# EAGLE design RPi-WS2812-HAT_v10 (EAGLE 7.5.0)

## Sheet 1 of 2
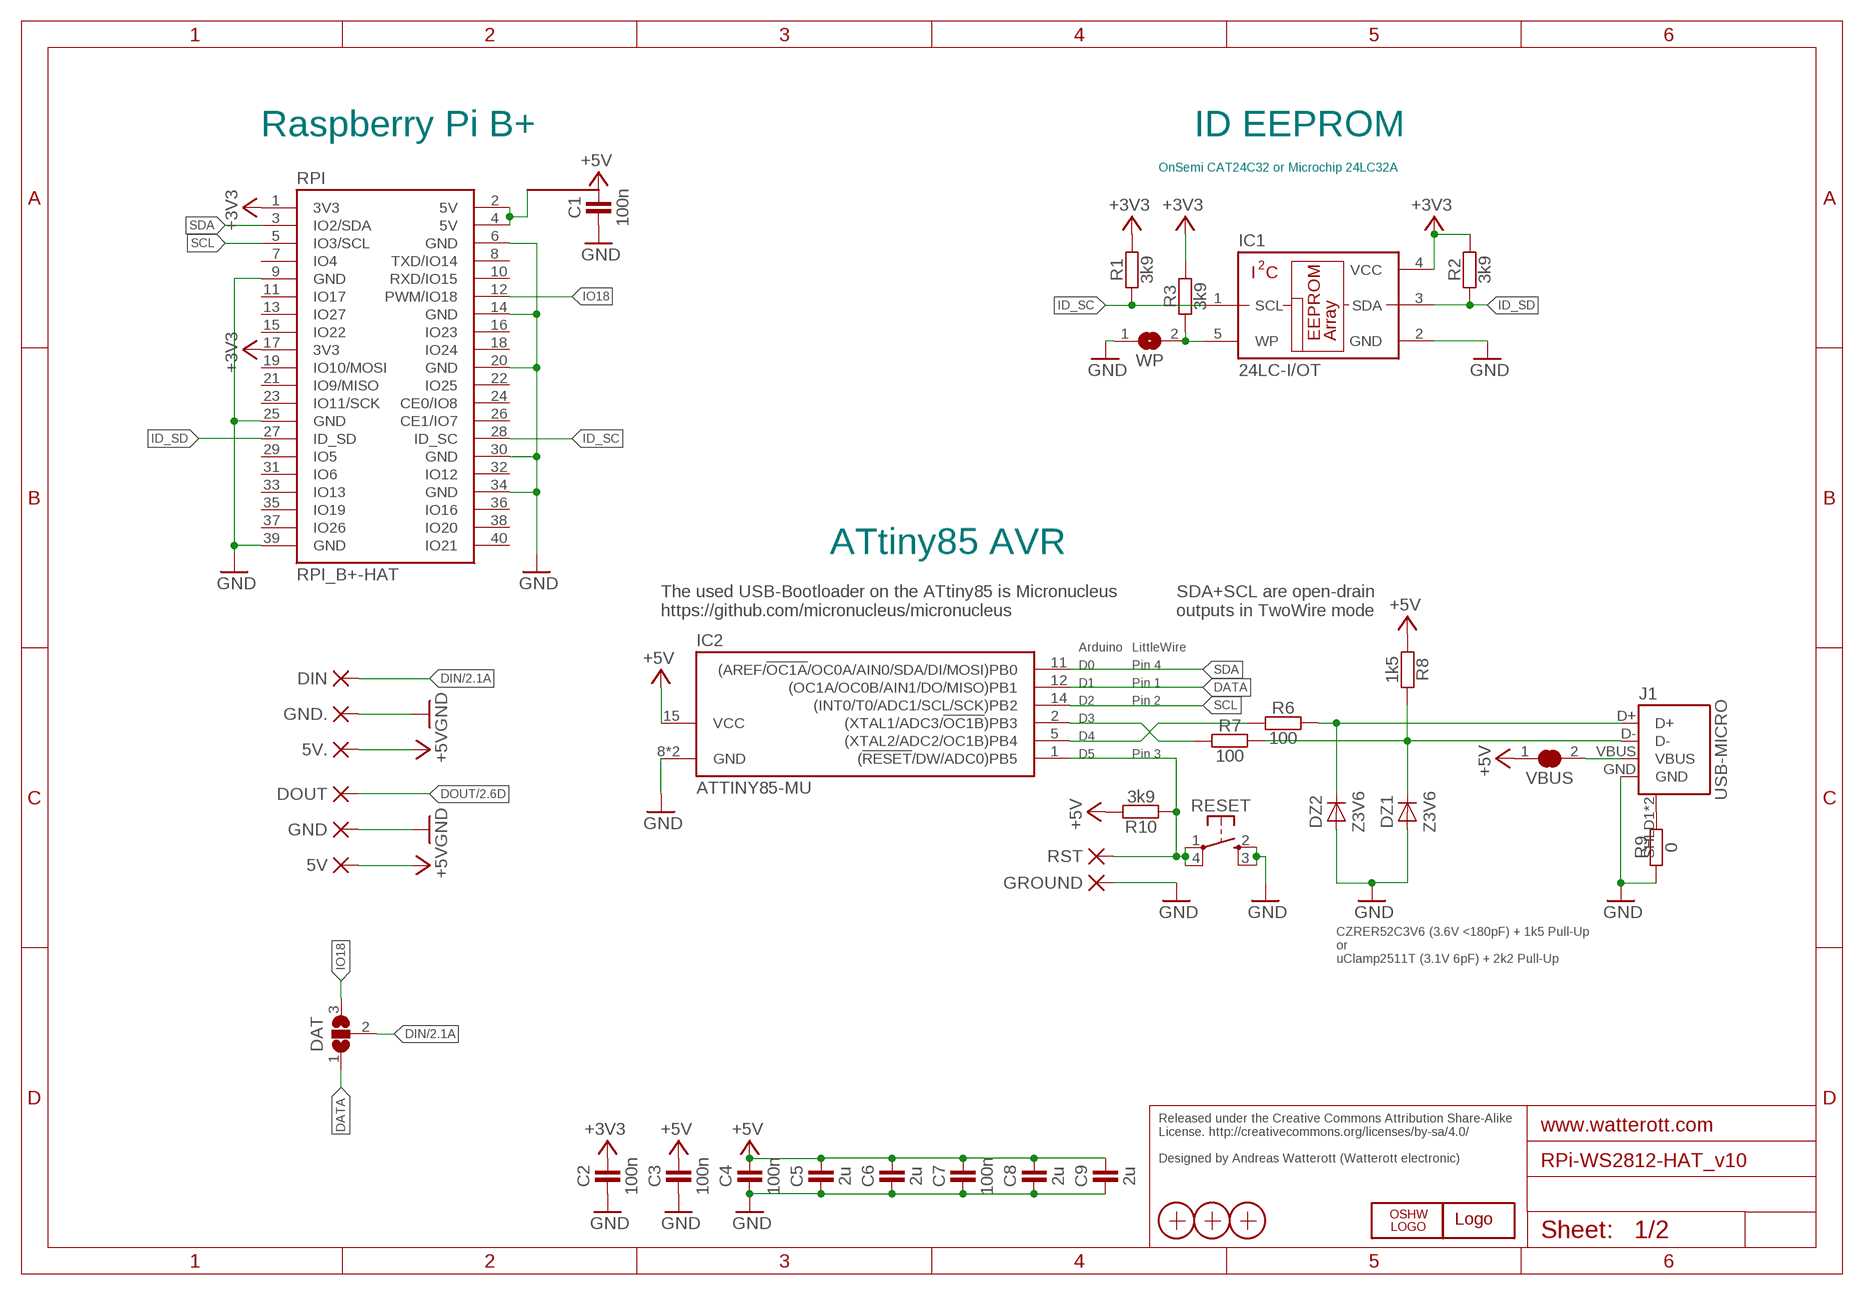
[diagram p0: schematic, sheet 1]

### Parts
5V  PAD-1.27X2.54_NC  [PAD-1.27X2.54_NC]
5V.  PAD-1.27X2.54_NC  [PAD-1.27X2.54_NC]
C1  100n  CAPACITOR-0402  [C0402]
C2  100n  CAPACITOR-0402  [C0402]
C3  100n  CAPACITOR-0402  [C0402]
C4  100n  CAPACITOR-0402  [C0402]
C5  2u  CAPACITOR-0402  [C0402]
C6  2u  CAPACITOR-0402  [C0402]
C7  100n  CAPACITOR-0402  [C0402]
C8  2u  CAPACITOR-0402  [C0402]
C9  2u  CAPACITOR-0402  [C0402]
DAT  JUMPER3-0603  [JUMPER3-0603]
DIN  PAD-1.27X2.54_NC  [PAD-1.27X2.54_NC]
DOUT  PAD-1.27X2.54_NC  [PAD-1.27X2.54_NC]
DZ1  Z3V6  DIODE-SOD882  [SOD882]
DZ2  Z3V6  DIODE-SOD882  [SOD882]
GND  PAD-1.27X2.54_NC  [PAD-1.27X2.54_NC]
GND.  PAD-1.27X2.54_NC  [PAD-1.27X2.54_NC]
GROUND  PAD-1.27X1.27_NC  [PAD-1.27X1.27_NC]
IC1  24LC-I/OT  [SOT23-5]
IC2  ATTINY85-MU  [QFN20-PAD]
J1  USB-MICRO  [USB-MICRO-10103594]
LOGO1  LOGO-S_PLACE_S  [SPARK_TPLACE_S]
LOGO2  OSHW_LOGOX0070  [OSHW_6X70]
R1  3k9  RESISTOR-0402  [C0402]
R2  3k9  RESISTOR-0402  [C0402]
R3  3k9  RESISTOR-0402  [C0402]
R6  100  RESISTOR-0402  [C0402]
R7  100  RESISTOR-0402  [C0402]
R8  1k5  RESISTOR-0402  [C0402]
R9  0  RESISTOR-0402  [C0402]
R10  3k9  RESISTOR-0402  [C0402]
RESET  SW-TACTILE-TL3315  [SW_TL3315N]
RPI  RPI_B+-HAT  [RPI-B+HAT]
RST  PAD-1.27X1.27_NC  [PAD-1.27X1.27_NC]
VBUS  JUMPER2-0603-NC  [JUMPER2-0603_NC]
WP  JUMPER2-0603-NC  [JUMPER2-0603_NC]
X1  PASSER-07  [PASSER_07MM]
X2  PASSER-07  [PASSER_07MM]
X3  PASSER-07  [PASSER_07MM]

### Nets
5V: RPI.2(5V) RPI.4(5V)
+3V3: C2.2 IC1.4(VCC) R1.2 R2.2 R3.2 RPI.1(3V3) RPI.17(3V3)
+5V: 5V.1(P) 5V..1(P) C1.2 C3.2 C4.2 C5.2 C6.2 C7.2 C8.2 C9.2 IC2.15(VCC) R8.1 R10.2 VBUS.1 ; also sheet 2
D2_N: IC2.2((XTAL1/ADC3/!OC1B!)PB3) R7.1
D2_P: IC2.5((XTAL2/ADC2/OC1B)PB4) R6.1
D_N: DZ1.C J1.D- R7.2 R8.2
D_P: DZ2.C J1.D+ R6.2
DATA: DAT.1 IC2.12((OC1A/OC0B/AIN1/DO/MISO)PB1)
DIN: DAT.2 DIN.1(P) ; also sheet 2
DOUT: DOUT.1(P) ; also sheet 2
GND: C1.1 C2.1 C3.1 C4.1 C5.1 C6.1 C7.1 C8.1 C9.1 DZ1.A DZ2.A GND.1(P) GND..1(P) GROUND.1(P) IC1.2(GND) IC2.8(GND) IC2.TP(GND) J1.GND R9.1 RESET.2(S1) RESET.3(S2) RPI.6(GND) RPI.9(GND) RPI.14(GND) RPI.20(GND) RPI.25(GND) RPI.30(GND) RPI.34(GND) RPI.39(GND) WP.1 ; also sheet 2
ID_SC: IC1.1(SCL) R1.1 RPI.28(ID_SC)
ID_SD: IC1.3(SDA) R2.1 RPI.27(ID_SD)
IO18: DAT.3 RPI.12(PWM/IO18)
N$8: J1.SHLD1(SHIELD) J1.SHLD2(SHIELD) R9.2
RST: IC2.1((!RESET!/DW/ADC0)PB5) R10.1 RESET.1 RESET.4(P2) RST.1(P)
SCL: IC2.14((INT0/T0/ADC1/SCL/SCK)PB2) RPI.5(IO3/SCL)
SDA: IC2.11((AREF/!OC1A!/OC0A/AIN0/SDA/DI/MOSI)PB0) RPI.3(IO2/SDA)
VBUS: J1.VBUS VBUS.2
WP: IC1.5(WP) R3.1 WP.2
Unconnected: RPI.7(IO4) RPI.8(TXD/IO14) RPI.10(RXD/IO15) RPI.11(IO17) RPI.13(IO27) RPI.15(IO22) RPI.16(IO23) RPI.18(IO24) RPI.19(IO10/MOSI) RPI.21(IO9/MISO) RPI.22(IO25) RPI.23(IO11/SCK) RPI.24(CE0/IO8) RPI.26(CE1/IO7) RPI.29(IO5) RPI.31(IO6) RPI.32(IO12) RPI.33(IO13) RPI.35(IO19) RPI.36(IO16) RPI.37(IO26) RPI.38(IO20) RPI.40(IO21)

### Notes on the sheet
- Raspberry Pi B+ | ID EEPROM
- OnSemi CAT24C32 or Microchip 24LC32A
- ATtiny85 AVR
- The used USB-Bootloader on the ATtiny85 is Micronucleus 
  https://github.com/micronucleus/micronucleus
- SDA+SCL are open-drain
  outputs in TwoWire mode
- Arduino | LittleWire
- D0 | Pin 4
- D1 | Pin 1
- D2 | Pin 2
- D3
- D4
- D5 | Pin 3
- CZRER52C3V6 (3.6V <180pF) + 1k5 Pull-Up
  or
  uClamp2511T (3.1V 6pF) + 2k2 Pull-Up
- Released under the Creative Commons Attribution Share-Alike 
  License. http://creativecommons.org/licenses/by-sa/4.0/
  
  Designed by Andreas Watterott (Watterott electronic)

## Sheet 2 of 2
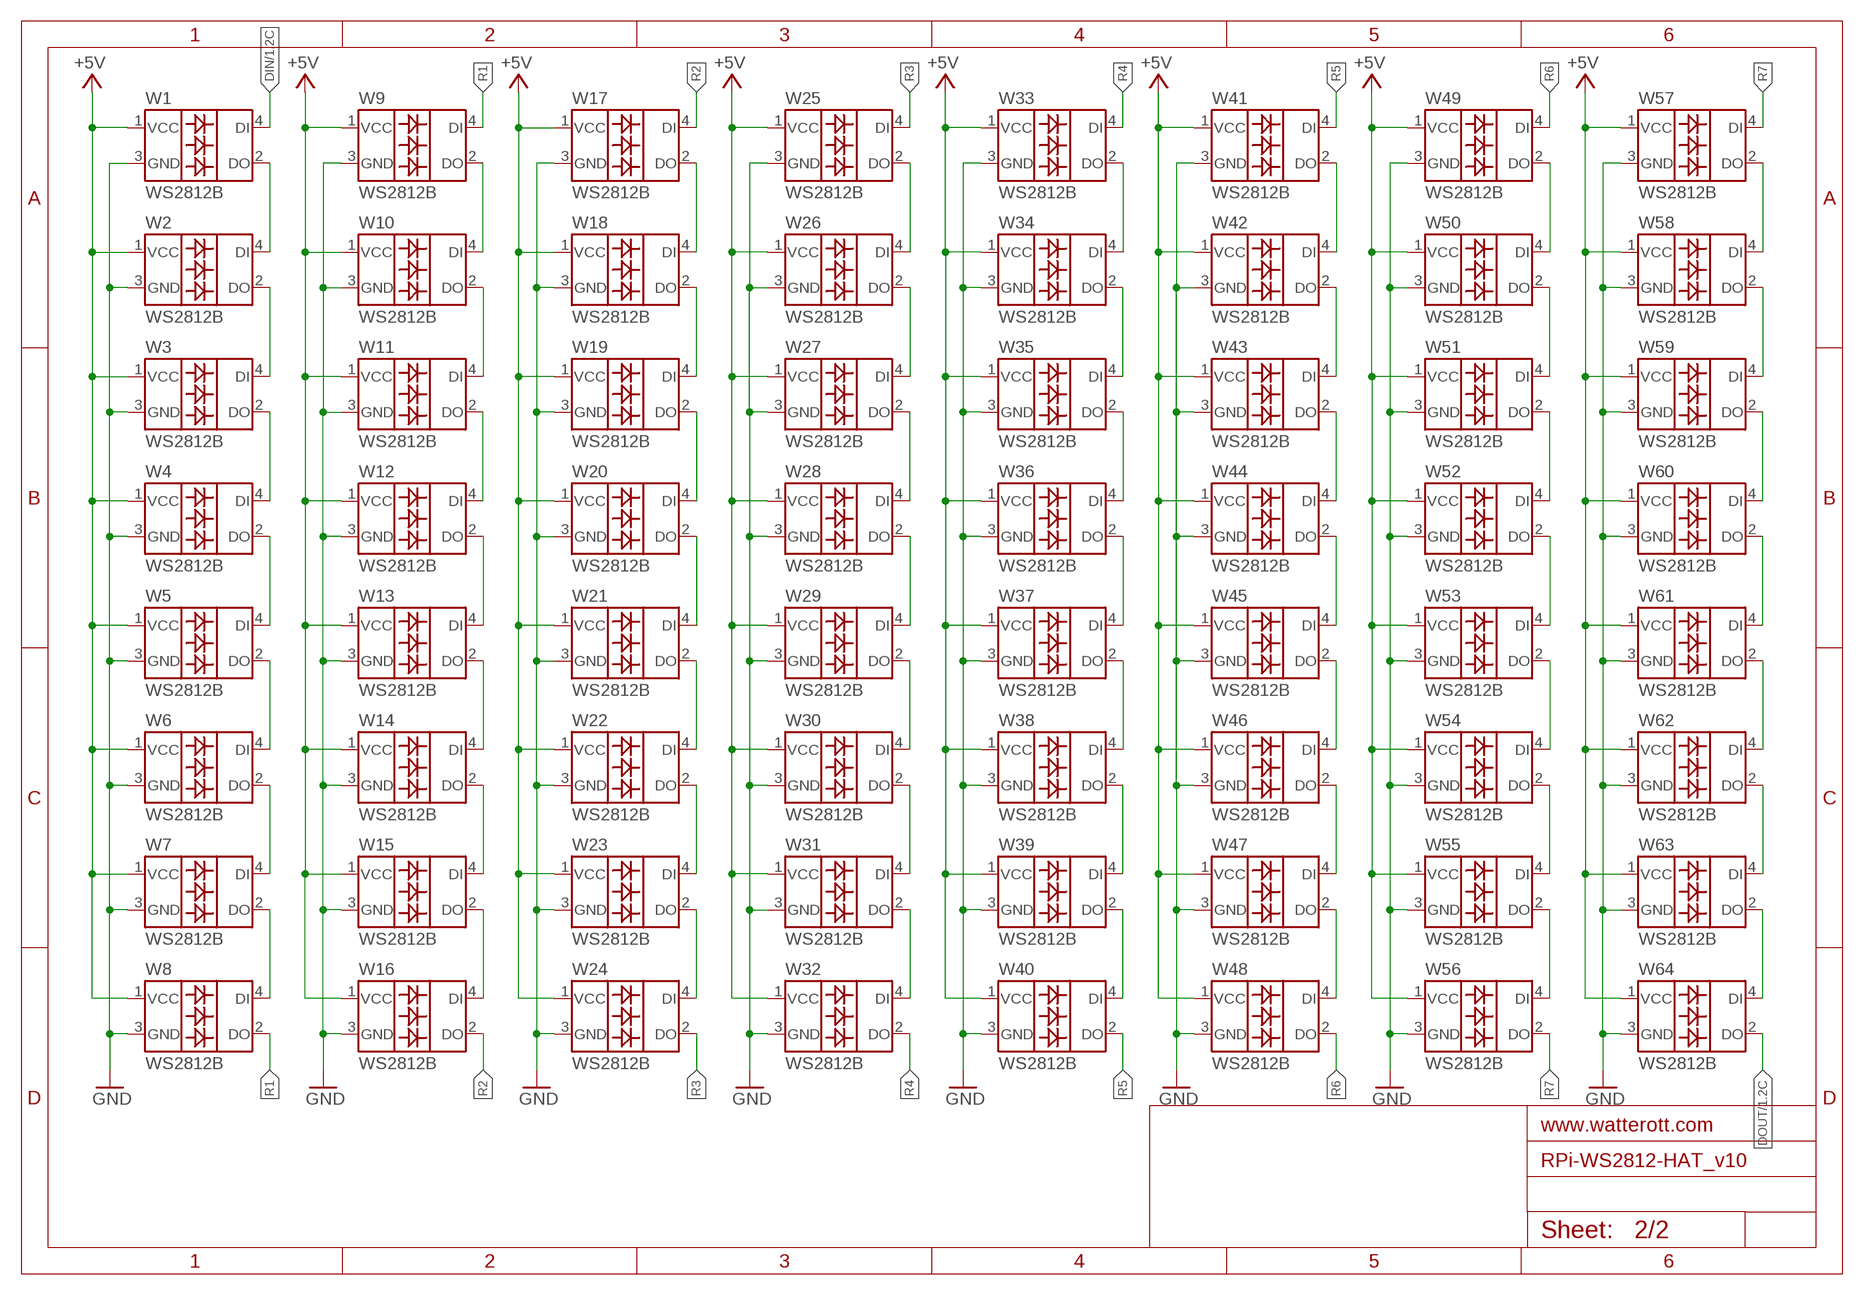
[diagram p1: schematic, sheet 2]

### Parts
W1  WS2812B  [WS2812B]
W2  WS2812B  [WS2812B]
W3  WS2812B  [WS2812B]
W4  WS2812B  [WS2812B]
W5  WS2812B  [WS2812B]
W6  WS2812B  [WS2812B]
W7  WS2812B  [WS2812B]
W8  WS2812B  [WS2812B]
W9  WS2812B  [WS2812B]
W10  WS2812B  [WS2812B]
W11  WS2812B  [WS2812B]
W12  WS2812B  [WS2812B]
W13  WS2812B  [WS2812B]
W14  WS2812B  [WS2812B]
W15  WS2812B  [WS2812B]
W16  WS2812B  [WS2812B]
W17  WS2812B  [WS2812B]
W18  WS2812B  [WS2812B]
W19  WS2812B  [WS2812B]
W20  WS2812B  [WS2812B]
W21  WS2812B  [WS2812B]
W22  WS2812B  [WS2812B]
W23  WS2812B  [WS2812B]
W24  WS2812B  [WS2812B]
W25  WS2812B  [WS2812B]
W26  WS2812B  [WS2812B]
W27  WS2812B  [WS2812B]
W28  WS2812B  [WS2812B]
W29  WS2812B  [WS2812B]
W30  WS2812B  [WS2812B]
W31  WS2812B  [WS2812B]
W32  WS2812B  [WS2812B]
W33  WS2812B  [WS2812B]
W34  WS2812B  [WS2812B]
W35  WS2812B  [WS2812B]
W36  WS2812B  [WS2812B]
W37  WS2812B  [WS2812B]
W38  WS2812B  [WS2812B]
W39  WS2812B  [WS2812B]
W40  WS2812B  [WS2812B]
W41  WS2812B  [WS2812B]
W42  WS2812B  [WS2812B]
W43  WS2812B  [WS2812B]
W44  WS2812B  [WS2812B]
W45  WS2812B  [WS2812B]
W46  WS2812B  [WS2812B]
W47  WS2812B  [WS2812B]
W48  WS2812B  [WS2812B]
W49  WS2812B  [WS2812B]
W50  WS2812B  [WS2812B]
W51  WS2812B  [WS2812B]
W52  WS2812B  [WS2812B]
W53  WS2812B  [WS2812B]
W54  WS2812B  [WS2812B]
W55  WS2812B  [WS2812B]
W56  WS2812B  [WS2812B]
W57  WS2812B  [WS2812B]
W58  WS2812B  [WS2812B]
W59  WS2812B  [WS2812B]
W60  WS2812B  [WS2812B]
W61  WS2812B  [WS2812B]
W62  WS2812B  [WS2812B]
W63  WS2812B  [WS2812B]
W64  WS2812B  [WS2812B]

### Nets
+5V: W1.1(VCC) W2.1(VCC) W3.1(VCC) W4.1(VCC) W5.1(VCC) W6.1(VCC) W7.1(VCC) W8.1(VCC) W9.1(VCC) W10.1(VCC) W11.1(VCC) W12.1(VCC) W13.1(VCC) W14.1(VCC) W15.1(VCC) W16.1(VCC) W17.1(VCC) W18.1(VCC) W19.1(VCC) W20.1(VCC) W21.1(VCC) W22.1(VCC) W23.1(VCC) W24.1(VCC) W25.1(VCC) W26.1(VCC) W27.1(VCC) W28.1(VCC) W29.1(VCC) W30.1(VCC) W31.1(VCC) W32.1(VCC) W33.1(VCC) W34.1(VCC) W35.1(VCC) W36.1(VCC) W37.1(VCC) W38.1(VCC) W39.1(VCC) W40.1(VCC) W41.1(VCC) W42.1(VCC) W43.1(VCC) W44.1(VCC) W45.1(VCC) W46.1(VCC) W47.1(VCC) W48.1(VCC) W49.1(VCC) W50.1(VCC) W51.1(VCC) W52.1(VCC) W53.1(VCC) W54.1(VCC) W55.1(VCC) W56.1(VCC) W57.1(VCC) W58.1(VCC) W59.1(VCC) W60.1(VCC) W61.1(VCC) W62.1(VCC) W63.1(VCC) W64.1(VCC) ; also sheet 1
DIN: W1.4(DI) ; also sheet 1
DOUT: W64.2(DO) ; also sheet 1
GND: W1.3(GND) W2.3(GND) W3.3(GND) W4.3(GND) W5.3(GND) W6.3(GND) W7.3(GND) W8.3(GND) W9.3(GND) W10.3(GND) W11.3(GND) W12.3(GND) W13.3(GND) W14.3(GND) W15.3(GND) W16.3(GND) W17.3(GND) W18.3(GND) W19.3(GND) W20.3(GND) W21.3(GND) W22.3(GND) W23.3(GND) W24.3(GND) W25.3(GND) W26.3(GND) W27.3(GND) W28.3(GND) W29.3(GND) W30.3(GND) W31.3(GND) W32.3(GND) W33.3(GND) W34.3(GND) W35.3(GND) W36.3(GND) W37.3(GND) W38.3(GND) W39.3(GND) W40.3(GND) W41.3(GND) W42.3(GND) W43.3(GND) W44.3(GND) W45.3(GND) W46.3(GND) W47.3(GND) W48.3(GND) W49.3(GND) W50.3(GND) W51.3(GND) W52.3(GND) W53.3(GND) W54.3(GND) W55.3(GND) W56.3(GND) W57.3(GND) W58.3(GND) W59.3(GND) W60.3(GND) W61.3(GND) W62.3(GND) W63.3(GND) W64.3(GND) ; also sheet 1
N$1: W1.2(DO) W2.4(DI)
N$2: W2.2(DO) W3.4(DI)
N$3: W3.2(DO) W4.4(DI)
N$4: W4.2(DO) W5.4(DI)
N$5: W5.2(DO) W6.4(DI)
N$6: W6.2(DO) W7.4(DI)
N$7: W7.2(DO) W8.4(DI)
N$9: W9.2(DO) W10.4(DI)
N$10: W10.2(DO) W11.4(DI)
N$11: W11.2(DO) W12.4(DI)
N$12: W12.2(DO) W13.4(DI)
N$13: W13.2(DO) W14.4(DI)
N$14: W15.2(DO) W16.4(DI)
N$15: W14.2(DO) W15.4(DI)
N$23: W23.2(DO) W24.4(DI)
N$24: W22.2(DO) W23.4(DI)
N$25: W21.2(DO) W22.4(DI)
N$26: W20.2(DO) W21.4(DI)
N$27: W19.2(DO) W20.4(DI)
N$28: W18.2(DO) W19.4(DI)
N$29: W17.2(DO) W18.4(DI)
N$30: W25.2(DO) W26.4(DI)
N$31: W26.2(DO) W27.4(DI)
N$32: W28.2(DO) W29.4(DI)
N$33: W27.2(DO) W28.4(DI)
N$34: W29.2(DO) W30.4(DI)
N$35: W31.2(DO) W32.4(DI)
N$36: W30.2(DO) W31.4(DI)
N$45: W55.2(DO) W56.4(DI)
N$47: W41.2(DO) W42.4(DI)
N$48: W33.2(DO) W34.4(DI)
N$49: W34.2(DO) W35.4(DI)
N$50: W42.2(DO) W43.4(DI)
N$51: W43.2(DO) W44.4(DI)
N$52: W35.2(DO) W36.4(DI)
N$53: W36.2(DO) W37.4(DI)
N$54: W37.2(DO) W38.4(DI)
N$55: W39.2(DO) W40.4(DI)
N$56: W47.2(DO) W48.4(DI)
N$57: W46.2(DO) W47.4(DI)
N$58: W54.2(DO) W55.4(DI)
N$59: W38.2(DO) W39.4(DI)
N$60: W45.2(DO) W46.4(DI)
N$61: W44.2(DO) W45.4(DI)
N$62: W52.2(DO) W53.4(DI)
N$63: W53.2(DO) W54.4(DI)
N$64: W51.2(DO) W52.4(DI)
N$65: W50.2(DO) W51.4(DI)
N$66: W49.2(DO) W50.4(DI)
N$76: W63.2(DO) W64.4(DI)
N$77: W62.2(DO) W63.4(DI)
N$78: W61.2(DO) W62.4(DI)
N$79: W60.2(DO) W61.4(DI)
N$80: W59.2(DO) W60.4(DI)
N$81: W57.2(DO) W58.4(DI)
N$82: W58.2(DO) W59.4(DI)
R1: W8.2(DO) W9.4(DI)
R2: W16.2(DO) W17.4(DI)
R3: W24.2(DO) W25.4(DI)
R4: W32.2(DO) W33.4(DI)
R5: W40.2(DO) W41.4(DI)
R6: W48.2(DO) W49.4(DI)
R7: W56.2(DO) W57.4(DI)

## Library data of the parts
5V 5V. DIN DOUT GND GND. GROUND RST = we-rcl:PAD: Pads
C1-C9 = we-rcl:CAPACITOR: Capacitors ...4.7uF @ 6.3V -> 0402 ...10uF @ 16V -> 0603 ...22uF @ 25V -> 0805
DAT = we-rcl:JUMPER3: 3 Pin Jumpers
DZ1 DZ2 = we-rcl:DIODE: Diodes
IC1 = we-chip:24LC*: Microchip I2C EEPROM 2 Kbit - 24LC02B - 24LC02BT-I/OTDKR-ND 32 Kbit- 24LC32A - 24LC32AT-I/OTDKR-ND; DIGIKEY: 24LC32AT-I/OTDKR-ND
IC2 = we-chip:ATTINY85: Atmel ATtiny25/45/85 AVR Microcontroller; DIGIKEY: ATTINY85-20MURDKR-ND
J1 = we-con:USB: USB Connectors; DIGIKEY: 609-4050-6-ND
LOGO1 = we-symbol:LOGO: Watterott electronic Logo
LOGO2 = we-symbol:OSHW_LOGO: Open-Source-Hardware Logo
R1-R3 R6-R10 = we-rcl:RESISTOR: Resistors all kinds in 0603 and 0402
RESET = we-switch:SW-TACTILE: Tactile Switches; DIGIKEY: EG4621TR-ND
RPI = we-board:RPI_B+: Raspberry Pi Model B+
VBUS WP = we-rcl:JUMPER2: 2 Pin Jumpers
W1-W64 = we-opto:WS2812B: WS2812 Intelligent RGB LED
X1-X3 = we-symbol:PASSER: Fiducial Markers

## Board
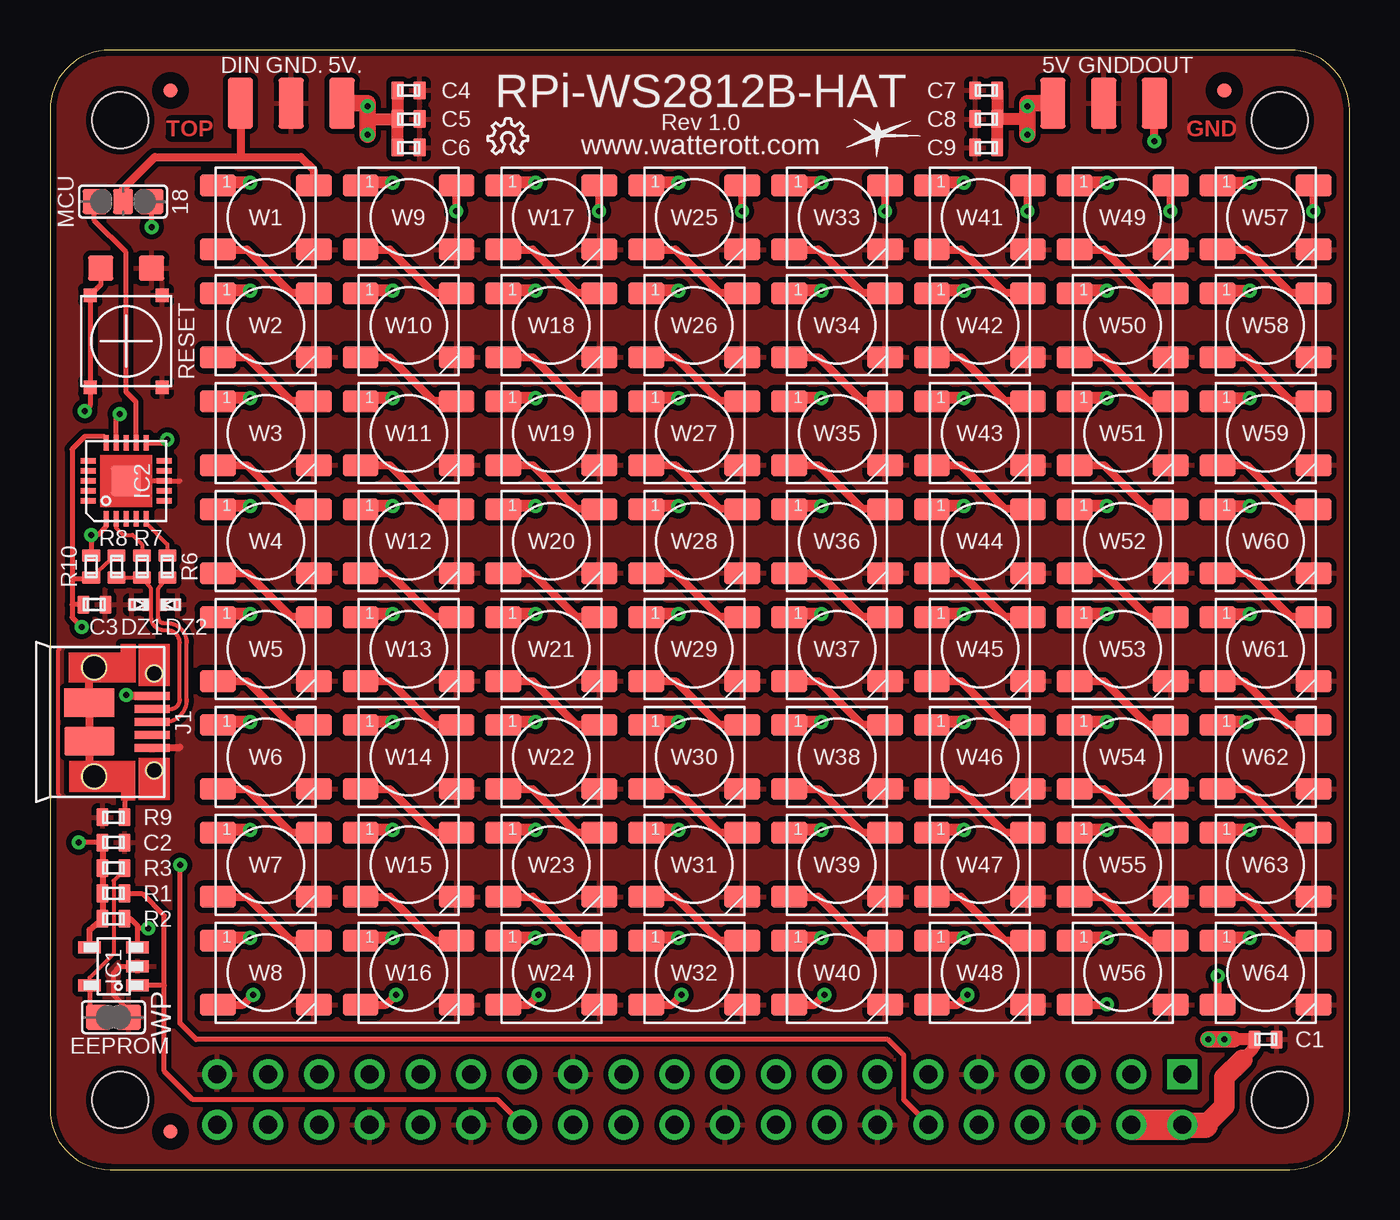
[diagram p2: board, top side]
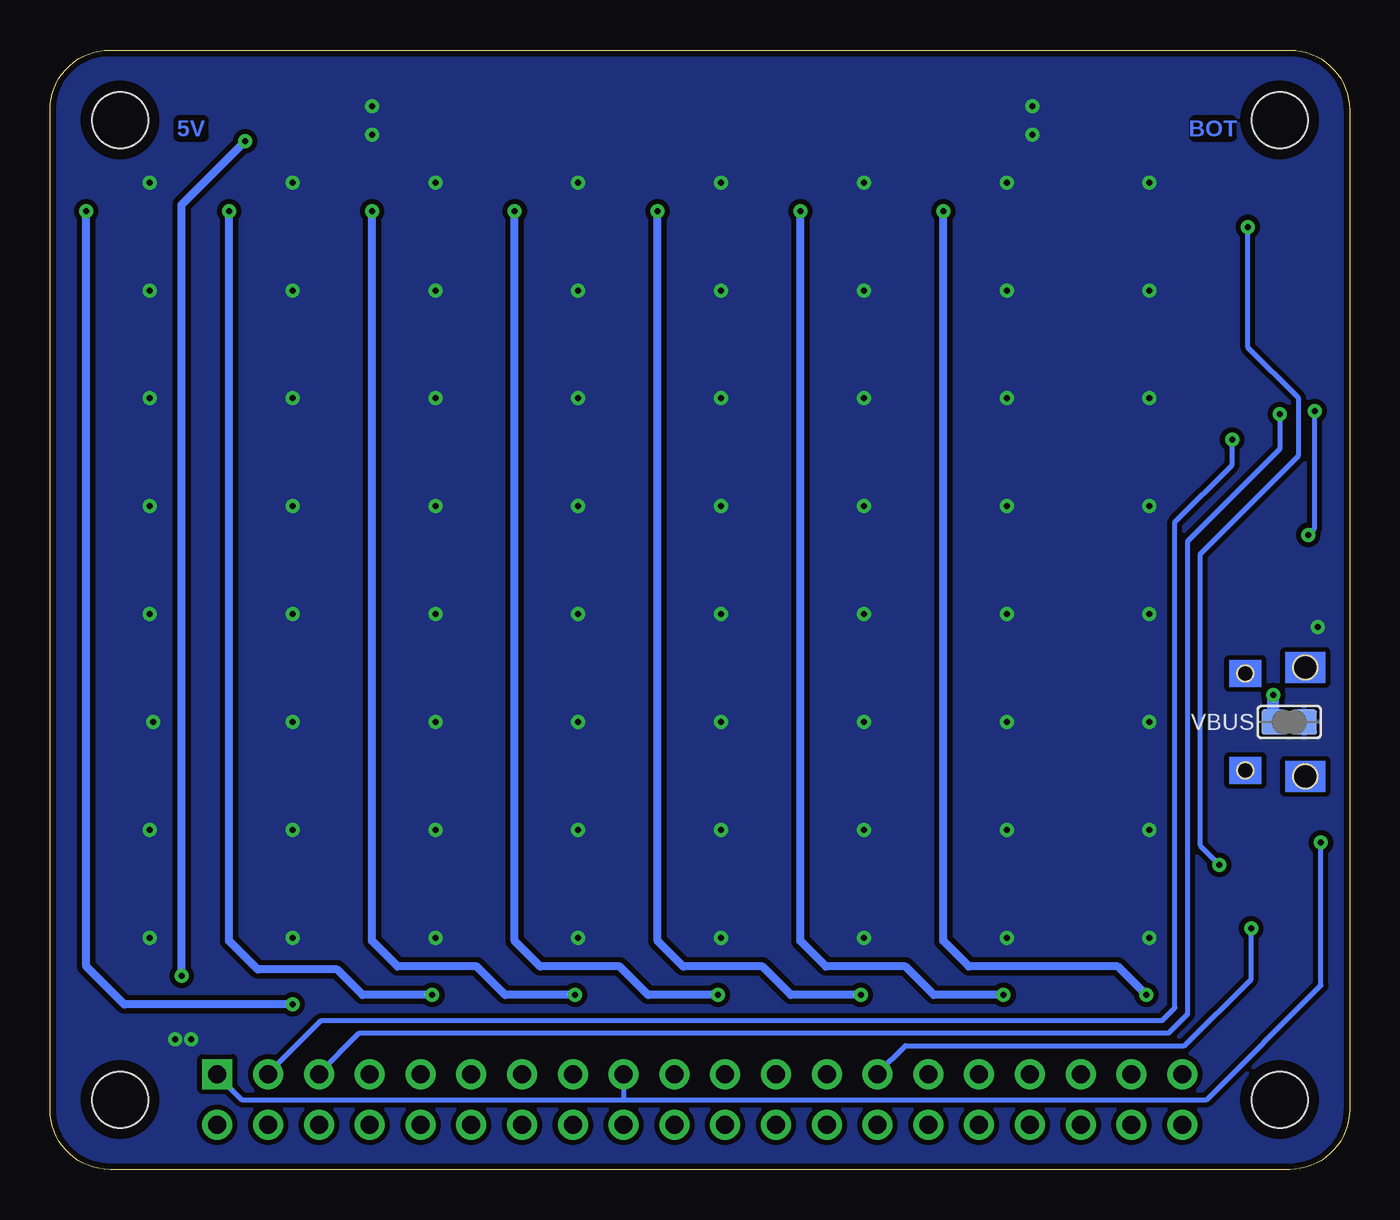
[diagram p3: board, bottom side, seen from below]

Size 65 x 56 mm. Coordinates in mm from the lower left corner, seen from the top.
Copper layers (1*16): Top 0.035mm / dielectric 1.5mm / Bottom 0.035mm
Design rules "we-dru *": minimum track width 0.15mm, minimum drill 0.3mm, track to track 0.15mm, track to pad 0.15mm, pad to pad 0.15mm, via to via 0.15mm, smd to smd 0.1mm, copper to edge 0.3mm, drill to drill 0.2mm, minimum pad ring 0.18mm, minimum via ring 0.2mm, stop-mask expansion 0.1mm, vias tented up to drill 0.5mm, thermal gap 0.25mm
bRestrict: area 60,51 to 63,54; area 2,51 to 5,54; area 60,2 to 63,5; area 2,2 to 5,5

### Footprints (pad centres in the part's own frame; a part is rotated, then mirrored left to right if it is on the bottom)
PAD-1.27X2.54_NC = smd 1.27 x 2.54: 1 0,0
C0402 = smd 0.9 x 0.6: 1 0,0.55; 2 0,-0.55
JUMPER3-0603 = smd 1.25 x 1.25: 1 0,1.4; 3 0,-1.4 | smd 1.25 x 1: 2 0,0
SOD882 = smd 0.65 x 0.4: A 0,-0.35; C 0,0.35
PAD-1.27X1.27_NC = smd 1.27 x 1.27: 1 0,0
SOT23-5 = smd 1.2 x 0.6: 1 -1.2,0.95; 2 -1.2,0; 3 -1.2,-0.95; 4 1.2,-0.95; 5 1.2,0.95
QFN20-PAD = smd 0.8 x 0.3: 1 -1.9,1; 2 -1.9,0.5; 3 -1.9,0; 4 -1.9,-0.5; 5 -1.9,-1; 11 1.9,-1; 12 1.9,-0.5; 13 1.9,0; 14 1.9,0.5; 15 1.9,1 | smd 0.3 x 0.8: 6 -1,-1.9; 7 -0.5,-1.9; 8 0,-1.9; 9 0.5,-1.9; 10 1,-1.9; 16 1,1.9; 17 0.5,1.9; 18 0,1.9; 19 -0.5,1.9; 20 -1,1.9 | smd 1.5 x 1.5: TP 0,0
USB-MICRO-10103594 = smd 1.8 x 0.4: D+ -2.885,0; D- -2.885,-0.65; GND -2.885,1.3; ID -2.885,0.65; VBUS -2.885,-1.3 | smd 2.5 x 1.425: SHLD1 0.25,-0.963; SHLD2 0.25,0.963 | hole 0.8: -3,2.425; -3,-2.425 | hole 1.2: 0.01,2.725; 0.01,-2.725
SW_TL3315N = smd 0.65 x 0.7: 1 -2.3,1.8; 2 -2.3,-1.8; 3 2.3,-1.8; 4 2.3,1.8
RPI-B+HAT = drill 0.9 pad 1.5 square: 1 56.63,4.77 | drill 0.9 pad 1.5: 2 56.63,2.23; 3 54.09,4.77; 4 54.09,2.23; 5 51.55,4.77; 6 51.55,2.23; 7 49.01,4.77; 8 49.01,2.23; 9 46.47,4.77; 10 46.47,2.23; 11 43.93,4.77; 12 43.93,2.23; 13 41.39,4.77; 14 41.39,2.23; 15 38.85,4.77; 16 38.85,2.23; 17 36.31,4.77; 18 36.31,2.23; 19 33.77,4.77; 20 33.77,2.23; 21 31.23,4.77; 22 31.23,2.23; 23 28.69,4.77; 24 28.69,2.23; 25 26.15,4.77; 26 26.15,2.23; 27 23.61,4.77; 28 23.61,2.23; 29 21.07,4.77; 30 21.07,2.23; 31 18.53,4.77; 32 18.53,2.23; 33 15.99,4.77; 34 15.99,2.23; 35 13.45,4.77; 36 13.45,2.23; 37 10.91,4.77; 38 10.91,2.23; 39 8.37,4.77; 40 8.37,2.23 | hole 2.8: 3.5,3.5; 3.5,52.5; 61.5,52.5; 61.5,3.5
JUMPER2-0603_NC = smd 1.25 x 1.25: 1 0,0.76; 2 0,-0.76
WS2812B = smd 1.8 x 1.1: 1 -2.4,1.6; 2 -2.4,-1.6; 3 2.4,-1.6; 4 2.4,1.6
PASSER_07MM = smd 0.7 x 0.7: X 0,0

### Placement (x,y rotation side)
5V  50.16,53.34 180 top
5V.  14.61,53.34 180 top
C1  60.8,6.51 270 top
C2  3.17,16.35 270 top
C3  2.22,28.26 270 top
C4  17.94,53.98 270 top
C5  17.94,52.55 270 top
C6  17.94,51.12 270 top
C7  46.83,53.98 90 top
C8  46.83,52.55 90 top
C9  46.83,51.12 90 top
DAT  3.65,48.42 90 top
DIN  9.53,53.34 180 top
DOUT  55.24,53.34 180 top
DZ1  4.45,28.26 270 top
DZ2  6.03,28.26 90 top
GND  52.7,53.34 180 top
GND.  12.06,53.34 180 top
GROUND  5.08,45.09 270 top
IC1  3.17,10.16 180 top
IC2  3.81,34.45 90 top
J1  2.22,22.38 180 top
LOGO1  41.43,51.75 0 top
LOGO2  21.91,50.8 0 top
R1  3.17,13.81 270 top
R2  3.17,12.54 270 top
R3  3.17,15.08 270 top
R6  5.87,30.16 0 top
R7  4.6,30.16 0 top
R8  3.33,30.16 0 top
R9  3.17,17.62 90 top
R10  2.06,30.16 0 top
RESET  3.81,41.43 90 top
RPI  0,0 0 top
RST  2.54,45.09 270 top
VBUS  3.02,22.38 270 bottom
W1  10.79,47.62 0 top
W2  10.79,42.23 0 top
W3  10.79,36.83 0 top
W4  10.79,31.43 0 top
W5  10.79,26.04 0 top
W6  10.79,20.64 0 top
W7  10.79,15.24 0 top
W8  10.79,9.84 0 top
W9  17.94,47.62 0 top
W10  17.94,42.23 0 top
W11  17.94,36.83 0 top
W12  17.94,31.43 0 top
W13  17.94,26.04 0 top
W14  17.94,20.64 0 top
W15  17.94,15.24 0 top
W16  17.94,9.84 0 top
W17  25.08,47.62 0 top
W18  25.08,42.23 0 top
W19  25.08,36.83 0 top
W20  25.08,31.43 0 top
W21  25.08,26.04 0 top
W22  25.08,20.64 0 top
W23  25.08,15.24 0 top
W24  25.08,9.84 0 top
W25  32.23,47.62 0 top
W26  32.23,42.23 0 top
W27  32.23,36.83 0 top
W28  32.23,31.43 0 top
W29  32.23,26.04 0 top
W30  32.23,20.64 0 top
W31  32.23,15.24 0 top
W32  32.23,9.84 0 top
W33  39.37,47.62 0 top
W34  39.37,42.23 0 top
W35  39.37,36.83 0 top
W36  39.37,31.43 0 top
W37  39.37,26.04 0 top
W38  39.37,20.64 0 top
W39  39.37,15.24 0 top
W40  39.37,9.84 0 top
W41  46.51,47.62 0 top
W42  46.51,42.23 0 top
W43  46.51,36.83 0 top
W44  46.51,31.43 0 top
W45  46.51,26.04 0 top
W46  46.51,20.64 0 top
W47  46.51,15.24 0 top
W48  46.51,9.84 0 top
W49  53.66,47.62 0 top
W50  53.66,42.23 0 top
W51  53.66,36.83 0 top
W52  53.66,31.43 0 top
W53  53.66,26.04 0 top
W54  53.66,20.64 0 top
W55  53.66,15.24 0 top
W56  53.66,9.84 0 top
W57  60.8,47.62 0 top
W58  60.8,42.23 0 top
W59  60.8,36.83 0 top
W60  60.8,31.43 0 top
W61  60.8,26.04 0 top
W62  60.8,20.64 0 top
W63  60.8,15.24 0 top
W64  60.8,9.84 0 top
WP  3.17,7.62 270 top
X1  6.03,1.91 0 top
X2  6.03,53.98 0 top
X3  58.74,53.98 0 top

### Tracks (layer width: path | path; a pad name or v marks a point on that pad's centre or on a via)
5V
  Top 0.254: RPI.4 54.64,2.23
  Top 1.524: RPI.4 RPI.2
+3V3  (via drill 0.3)
  Top 0.254: C2.2 v1.43,16.35
  Top 0.305: IC1.4 1.98,11.99 R2.2 R1.2 R3.2 C2.2
  Bottom 0.254: RPI.1 56.63,4.72 55.4,3.49 36.35,3.49 | 36.35,3.49 7.14,3.49 1.43,9.21 v1.43,16.35 | RPI.17 36.31,3.54 36.35,3.49
+5V  (via drill 0.3)
  Top 0.203: R8.1 3.33,30.78 R10.2
  Top 0.254: IC2.15 2.81,36.56 2.7,36.67 1.75,36.67 1.11,36.04 1.11,29.53 | R10.2 2.06,29.53 1.11,29.53 | 1.11,29.53 1.11,28.26 | 1.11,28.26 1.11,27.62 v1.59,27.15 | C3.2 1.11,28.26
  Top 0.406: W57.1 58.43,49.23
  Top 0.61: v10,49.37 8.39,49.37 W1.1 | v17.14,49.37 15.54,49.37 W9.1 | v24.29,49.37 22.68,49.37 W17.1 | v31.43,49.37 29.83,49.37 W25.1 | v38.58,49.37 36.97,49.37 W33.1 | v45.72,49.37 44.11,49.37 W41.1 | v52.86,49.37 51.26,49.37 W49.1 | v52.86,43.97 51.26,43.97 W50.1 | v52.86,38.58 51.26,38.58 W51.1 | v45.72,43.97 44.11,43.97 W42.1 | v45.72,38.58 44.11,38.58 W43.1 | v38.58,43.97 36.97,43.97 W34.1 | v38.58,38.58 36.97,38.58 W35.1 | v31.43,43.97 29.83,43.97 W26.1 | v31.43,38.58 29.83,38.58 W27.1 | v24.29,38.58 22.68,38.58 W19.1 | v24.29,43.97 22.68,43.97 W18.1 | v17.14,43.97 15.54,43.97 W10.1 | v10,43.97 8.39,43.97 W2.1 | v10,38.58 8.39,38.58 W3.1 | v17.14,38.58 15.54,38.58 W11.1 | v10,33.18 8.39,33.18 W4.1 | v10,27.78 8.39,27.78 W5.1 | v10,22.38 8.39,22.38 W6.1 | v10,11.59 8.39,11.59 W8.1 | v10,16.99 8.39,16.99 W7.1 | v17.14,16.99 15.54,16.99 W15.1 | v17.14,11.59 15.54,11.59 W16.1 | v24.29,11.59 22.68,11.59 W24.1 | v31.43,11.59 29.83,11.59 W32.1 | v60.01,11.59 58.4,11.59 W64.1 | v52.86,11.59 51.26,11.59 W56.1 | v45.72,11.59 44.11,11.59 W48.1 | v38.58,11.59 36.97,11.59 W40.1 | v60.01,16.99 58.4,16.99 W63.1 | v52.86,16.99 51.26,16.99 W55.1 | v45.72,16.99 44.11,16.99 W47.1 | v38.58,16.99 36.97,16.99 W39.1 | v31.43,16.99 29.83,16.99 W31.1 | v24.29,16.99 22.68,16.99 W23.1 | v17.14,22.38 15.54,22.38 W14.1 | v24.29,22.38 22.68,22.38 W22.1 | v31.43,22.38 29.83,22.38 W30.1 | v59.85,22.38 58.4,22.38 W62.1 | v52.86,22.38 51.26,22.38 W54.1 | v45.72,22.38 44.11,22.38 W46.1 | v38.58,22.38 36.97,22.38 W38.1 | v52.86,27.78 51.26,27.78 W53.1 | v45.72,27.78 44.11,27.78 W45.1 | v38.58,27.78 36.97,27.78 W37.1 | v31.43,27.78 29.83,27.78 W29.1 | v24.29,27.78 22.68,27.78 W21.1
  Top 0.61: v17.14,27.78 15.54,27.78 W13.1 | v17.14,33.18 15.54,33.18 W12.1 | v24.29,33.18 22.68,33.18 W20.1 | v31.43,33.18 29.83,33.18 W28.1 | v45.72,33.18 44.11,33.18 W44.1 | v38.58,33.18 36.97,33.18 W36.1 | v52.86,33.18 51.26,33.18 W52.1 | 58.43,49.23 58.58,49.37 v60.01,49.37 | W58.1 58.43,43.83 58.58,43.97 v60.01,43.97 | W59.1 58.59,38.43 58.74,38.58 v60.01,38.58 | W61.1 58.43,27.64 58.58,27.78 v60.01,27.78 | W60.1 58.43,33.03 58.58,33.18 v60.01,33.18 | 59.21,6.51 C1.2 60.15,6.02 59.63,5.5 | C7.2 C8.2 | C9.2 C8.2 | 48.9,52.55 C8.2 | 15.88,52.55 C5.2 | C4.2 C5.2 | C6.2 C5.2
  Top 0.813: 59.21,6.51 v57.94,6.51 | v48.9,51.75 48.9,52.55 v48.9,53.18 48.9,53.34 5V.1 | v15.88,51.75 15.88,52.55 v15.88,53.18 15.88,53.34 5V..1
  Top 1.016: 59.63,5.5 58.74,4.6 58.74,3.17 57.78,2.22
  Top 1.27: 57.78,2.22 56.52,2.22
  other vias: 58.74,6.51
  pour Bottom (isolate 0.254): 0,0 65,0 65,56 0,56
D2_N
  Top 0.203: IC2.2 3.31,32.09 3.65,31.75 4.13,31.75 4.6,31.27 R7.1
D2_P
  Top 0.203: IC2.5 4.81,32.34 5.87,31.27 R6.1
D_N
  Top 0.203: J1.D- 6.03,23.03 arc90 6.49,23.5 6.49,26.35 arc90 5.87,26.97 5.71,26.97 arc-90 5.06,27.62 5.06,28.26 | 5.06,28.26 5.06,29.05 R7.2 R8.2 | DZ1.C 5.06,28.26
D_P
  Top 0.203: J1.D+ 5.73,22.38 arc90 6.84,23.5 6.84,26.35 arc90 5.87,27.32 5.71,27.32 arc-90 5.42,27.62 5.42,28.26 | 5.42,28.26 5.42,29.05 R6.2 | DZ2.C 5.42,28.26
DATA
  Top 0.254: DAT.1 2.22,48.39 2.22,47.47 3.81,45.88 3.81,38.89 4.31,38.39 IC2.12
DIN
  Top 0.406: DIN.1 9.53,50.64 | 9.53,50.64 12.54,50.64 13.18,50.01 13.18,49.24 W1.4 | 9.53,50.64 5.24,50.64 3.65,49.05 DAT.2
DOUT  (via drill 0.3)
  Top 0.406: v55.24,51.44 DOUT.1 | W64.2 58.4,9.66 v58.42,9.68
  Bottom 0.406: v58.42,9.68 58.42,48.26 v55.24,51.44
GND
  Top 0.203: 0.48,26.04 0.4,25.96 0.4,18.81 0.48,18.73
  Top 0.254: WP.1 3.94,7.97 3.17,8.73 3.17,9.84 3.49,10.16 IC1.2 | IC2.TP IC2.8 6.51,34.45
  Top 0.356: 5.87,21.11 6.51,21.11
  pour Top (isolate 0.254): 0,0 65,0 65,56 0,56
ID_SC
  Top 0.203: IC1.1
  Top 0.254: 5.71,9.21 5.71,12.7 4.6,13.81 R1.1 | 5.71,9.21 IC1.1 | 5.71,9.21 5.71,4.92 7.14,3.49 22.38,3.49 23.61,2.27 RPI.28
ID_SD  (via drill 0.3)
  Top 0.254: IC1.3 4.38,12.06 | 4.38,12.06 4.38,12.19 4.03,12.54 R2.1 | v4.92,12.06 4.38,12.06
  Bottom 0.254: v4.92,12.06 4.92,9.53 8.26,6.19 22.23,6.19 23.61,4.81 RPI.27
IO18  (via drill 0.3)
  Top 0.254: v6.51,15.24 6.51,7.3 7.3,6.51 41.91,6.51 42.7,5.71 42.7,3.49 43.93,2.27 RPI.12 | v5.08,47.15 5.08,48.39 DAT.3
  Bottom 0.254: v5.08,47.15 5.08,41.12 2.54,38.58 2.54,35.72 7.46,30.8 7.46,16.19 v6.51,15.24
N$1
  Top 0.406: W1.2 9.86,46.02 12.05,43.83 W2.4
N$2
  Top 0.406: W2.2 9.86,40.63 12.05,38.43 W3.4
N$3
  Top 0.406: W3.2 9.86,35.23 12.05,33.03 W4.4
N$4
  Top 0.406: W4.2 9.86,29.83 12.05,27.64 W5.4
N$5
  Top 0.406: W5.2 9.86,24.43 12.05,22.24 W6.4
N$6
  Top 0.406: W6.2 9.86,19.04 12.05,16.84 W7.4
N$7
  Top 0.406: W7.2 9.86,13.64 12.05,11.44 W8.4
N$8
  Top 0.254: J1.SHLD1 J1.SHLD2 | R9.2 3.83,19.78 1.97,19.78
  Top 0.406: 1.97,19.78 J1.SHLD1 1.97,24.99
N$9
  Top 0.406: W9.2 17,46.02 19.2,43.83 W10.4
N$10
  Top 0.406: W10.2 17,40.63 19.2,38.43 W11.4
N$11
  Top 0.406: W11.2 17,35.23 19.2,33.03 W12.4
N$12
  Top 0.406: W12.2 17,29.83 19.2,27.64 W13.4
N$13
  Top 0.406: W13.2 17,24.43 19.2,22.24 W14.4
N$14
  Top 0.406: W15.2 17,13.64 19.2,11.44 W16.4
N$15
  Top 0.406: W14.2 17,19.04 19.2,16.84 W15.4
N$23
  Top 0.406: W23.2 24.14,13.64 26.34,11.44 W24.4
N$24
  Top 0.406: W22.2 24.14,19.04 26.34,16.84 W23.4
N$25
  Top 0.406: W21.2 24.14,24.43 26.34,22.24 W22.4
N$26
  Top 0.406: W20.2 24.14,29.83 26.34,27.64 W21.4
N$27
  Top 0.406: W19.2 24.14,35.23 26.34,33.03 W20.4
N$28
  Top 0.406: W18.2 24.14,40.63 26.34,38.43 W19.4
N$29
  Top 0.406: W17.2 24.14,46.02 26.34,43.83 W18.4
N$30
  Top 0.406: W25.2 31.29,46.02 33.48,43.83 W26.4
N$31
  Top 0.406: W26.2 31.29,40.63 33.48,38.43 W27.4
N$32
  Top 0.406: W28.2 31.29,29.83 33.48,27.64 W29.4
N$33
  Top 0.406: W27.2 31.29,35.23 33.48,33.03 W28.4
N$34
  Top 0.406: W29.2 31.29,24.43 33.48,22.24 W30.4
N$35
  Top 0.406: W31.2 31.29,13.64 33.48,11.44 W32.4
N$36
  Top 0.406: W30.2 31.29,19.04 33.48,16.84 W31.4
N$45
  Top 0.406: W55.2 52.72,13.64 54.91,11.44 W56.4
N$47
  Top 0.406: W41.2 45.57,46.02 47.77,43.83 W42.4
N$48
  Top 0.406: W33.2 38.43,46.02 40.63,43.83 W34.4
N$49
  Top 0.406: W34.2 38.43,40.63 40.63,38.43 W35.4
N$50
  Top 0.406: W42.2 45.57,40.63 47.77,38.43 W43.4
N$51
  Top 0.406: W43.2 45.57,35.23 47.77,33.03 W44.4
N$52
  Top 0.406: W35.2 38.43,35.23 40.63,33.03 W36.4
N$53
  Top 0.406: W36.2 38.43,29.83 40.63,27.64 W37.4
N$54
  Top 0.406: W37.2 38.43,24.43 40.63,22.24 W38.4
N$55
  Top 0.406: W39.2 38.43,13.64 40.63,11.44 W40.4
N$56
  Top 0.406: W47.2 45.57,13.64 47.77,11.44 W48.4
N$57
  Top 0.406: W46.2 45.57,19.04 47.77,16.84 W47.4
N$58
  Top 0.406: W54.2 52.72,19.04 54.91,16.84 W55.4
N$59
  Top 0.406: W38.2 38.43,19.04 40.63,16.84 W39.4
N$60
  Top 0.406: W45.2 45.57,24.43 47.77,22.24 W46.4
N$61
  Top 0.406: W44.2 45.57,29.83 47.77,27.64 W45.4
N$62
  Top 0.406: W52.2 52.72,29.83 54.91,27.64 W53.4
N$63
  Top 0.406: W53.2 52.72,24.43 54.91,22.24 W54.4
N$64
  Top 0.406: W51.2 52.72,35.23 54.91,33.03 W52.4
N$65
  Top 0.406: W50.2 52.72,40.63 54.91,38.43 W51.4
N$66
  Top 0.406: W49.2 52.72,46.02 54.91,43.83 W50.4
N$76
  Top 0.406: W63.2 59.86,13.64 62.06,11.44 W64.4
N$77
  Top 0.406: W62.2 59.86,19.04 62.06,16.84 W63.4
N$78
  Top 0.406: W61.2 59.7,24.43 61.9,22.24 W62.4
N$79
  Top 0.406: W60.2 59.86,29.83 62.06,27.64 W61.4
N$80
  Top 0.406: W59.2 59.86,35.23 62.06,33.03 W60.4
N$81
  Top 0.406: W57.2 59.86,46.02 62.06,43.83 W58.4
N$82
  Top 0.406: W58.2 59.86,40.63 62.06,38.43 W59.4
R1  (via drill 0.3)
  Top 0.406: W8.2 9.67,8.24 v10.16,8.73 | W9.4 20.32,49.21 v20.32,47.94
  Bottom 0.406: v10.16,8.73 11.59,10.16 19.05,10.16 20.32,11.43 v20.32,47.94
R2  (via drill 0.3)
  Top 0.406: W16.2 16.82,8.24 v17.3,8.73 | W17.4 27.48,49.07 27.46,49.05 v27.46,47.94
  Bottom 0.406: v17.3,8.73 20.8,8.73 22.23,10.16 26.19,10.16 27.46,11.43 v27.46,47.94
R3  (via drill 0.3)
  Top 0.406: W24.2 23.96,8.24 v24.45,8.73 | W25.4 34.63,49.07 34.61,49.05 v34.61,47.94
  Bottom 0.406: v24.45,8.73 27.94,8.73 29.37,10.16 33.34,10.16 34.61,11.43 v34.61,47.94
R4  (via drill 0.3)
  Top 0.406: W32.2 31.1,8.24 v31.59,8.73 | W33.4 41.75,49.21 v41.75,47.94
  Bottom 0.406: v31.59,8.73 35.08,8.73 36.51,10.16 40.48,10.16 41.75,11.43 v41.75,47.94
R5  (via drill 0.3)
  Top 0.406: W40.2 38.25,8.24 v38.73,8.73 | W41.4 48.91,49.07 48.9,49.05 v48.9,47.94
  Bottom 0.406: v48.9,47.94 48.9,11.43 47.62,10.16 43.66,10.16 42.23,8.73 v38.73,8.73
R6  (via drill 0.3)
  Top 0.406: W48.2 45.39,8.24 v45.88,8.73 | W49.4 56.06,49.07 56.04,49.05 v56.04,47.94
  Bottom 0.406: v45.88,8.73 49.37,8.73 50.64,10 54.61,10 56.04,11.43 v56.04,47.94
R7  (via drill 0.3)
  Top 0.406: W56.2 52.85,8.24 v52.86,8.26 | W57.4 63.2,49.07 63.18,49.05 v63.18,47.94
  Bottom 0.406: v52.86,8.26 61.28,8.26 63.18,10.16 v63.18,47.94
RST  (via drill 0.3)
  Top 0.254: R10.1 v2.06,31.75 2.38,31.75 2.81,32.18 IC2.1 | RST.1 2.54,44.26 RESET.4 RESET.1 2.01,38.2 v1.75,37.94
  Bottom 0.254: v2.06,31.75 1.75,32.07 v1.75,37.94
SCL  (via drill 0.3)
  Top 0.254: IC2.14 3.31,37.6 v3.49,37.78
  Bottom 0.254: v3.49,37.78 3.49,36.04 8.1,31.43 8.1,7.78 9.05,6.83 49.53,6.83 51.55,4.81 RPI.5
SDA  (via drill 0.3)
  Top 0.254: IC2.11 5.71,36.35 v5.87,36.51
  Bottom 0.254: RPI.3 54.09,4.81 51.44,7.46 9.37,7.46 8.73,8.1 8.73,32.38 5.87,35.24 v5.87,36.51
VBUS  (via drill 0.3)
  Top 0.406: J1.VBUS 3.86,23.68 v3.81,23.73
  Bottom 0.254: 3.81,22.38 2.54,22.38
  Bottom 0.406: VBUS.2 3.81,22.38
  Bottom 0.61: 3.81,22.38 v3.81,23.73
WP
  Top 0.203: R3.1 3.81,15.08 3.17,14.45 3.17,10.79 1.98,9.6 IC1.5
  Top 0.254: IC1.5 1.98,8.06 WP.2

### Text on the board
Top: TOP | GND
Bottom: BOT | 5V
tPlace: RPi-WS2812B-HAT | Rev 1.0 | www.watterott.com | MCU | 18 | EEPROM
Reference: Silkscreen: 21 tPlace